# EAGLE design PIUDaughterBoardV2 (EAGLE 7.4.0)
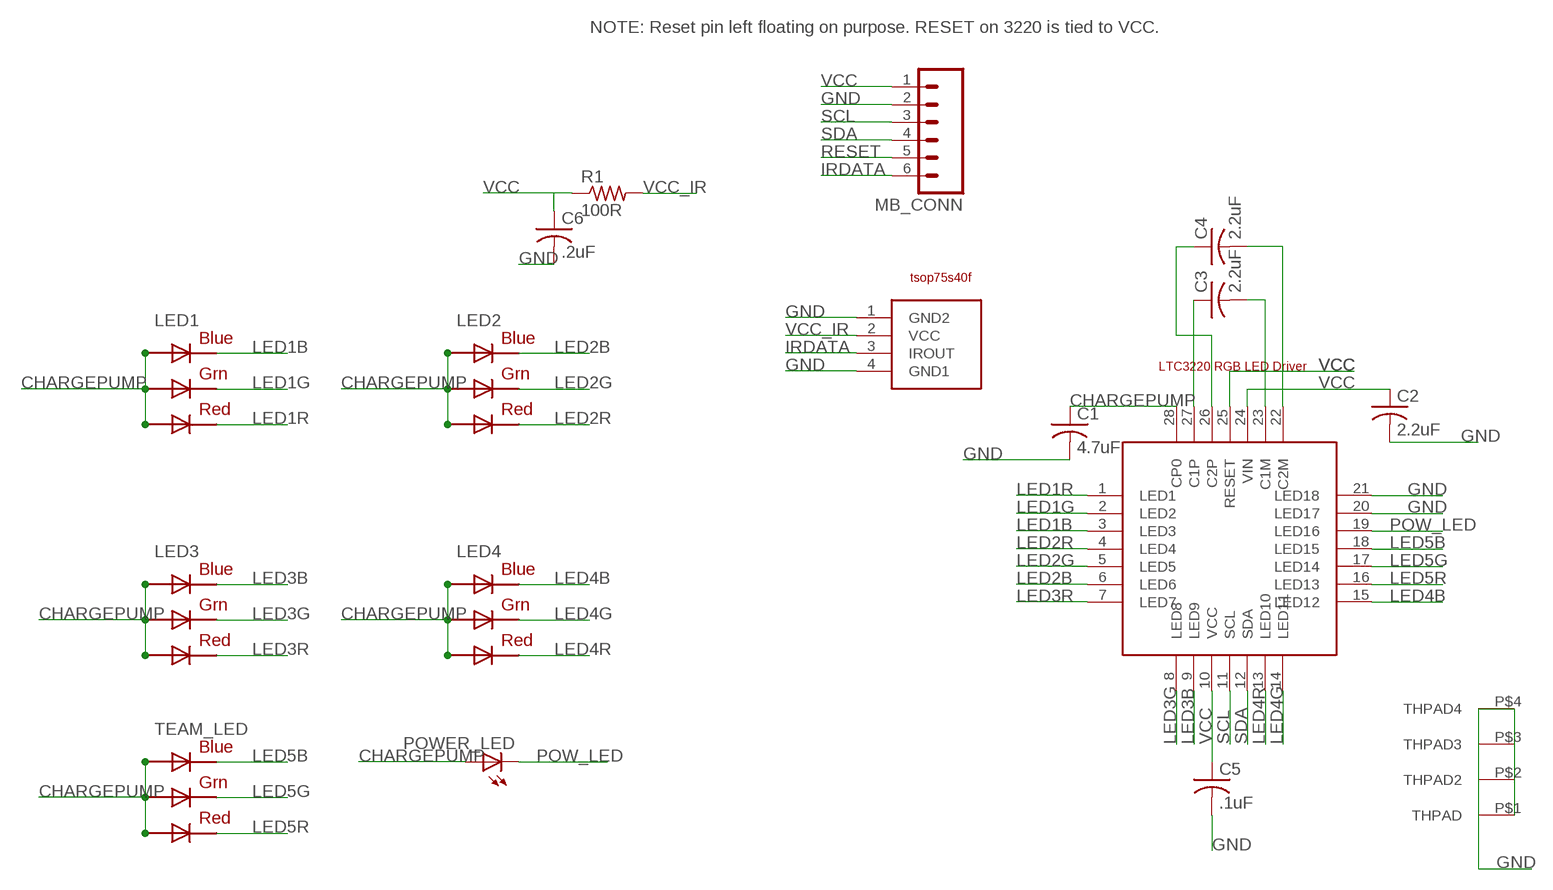
[diagram p0: schematic, sheet 1]

## Parts
C1  4.7uF  C-USC0603  [C0603]
C2  2.2uF  C-USC0603  [C0603]
C3  2.2uF  C-USC0603  [C0603]
C4  2.2uF  C-USC0603  [C0603]
C5  .1uF  C-USC0603  [C0603]
C6  .2uF  C-USC0603  [C0603]
LED1  RGBLED5050  [RGBLED5050]
LED2  RGBLED5050  [RGBLED5050]
LED3  RGBLED5050  [RGBLED5050]
LED4  RGBLED5050  [RGBLED5050]
MB_CONN  M06SMD_MALE  [1X06_SMD_MALE]
POWER_LED  LEDCHIPLED_0805  [CHIPLED_0805]
R1  100R  R-US_R0603  [R0603]
TEAM_LED  RGBLED5050  [RGBLED5050]
U$1  TSOP75S40F  [TSOP75S40F]
U$3  LTC3220  [LTC3220]

## Nets
CHARGEPUMP [ChargePump]: C1.1 LED1.1(GREEN_A) LED1.2(RED_A) LED1.3(BLUE_A) LED2.1(GREEN_A) LED2.2(RED_A) LED2.3(BLUE_A) LED3.1(GREEN_A) LED3.2(RED_A) LED3.3(BLUE_A) LED4.1(GREEN_A) LED4.2(RED_A) LED4.3(BLUE_A) POWER_LED.A TEAM_LED.1(GREEN_A) TEAM_LED.2(RED_A) TEAM_LED.3(BLUE_A) U$3.28(CP0)
GND [GND]: C1.2 C2.2 C5.2 C6.2 MB_CONN.2 U$1.1(GND2) U$1.4(GND1) U$3.20(LED17) U$3.21(LED18) U$3.P$1(THPAD) U$3.P$2(THPAD2) U$3.P$3(THPAD3) U$3.P$4(THPAD4)
IRDATA: MB_CONN.6 U$1.3(IROUT)
LED1B: LED1.4(BLUE_C) U$3.3(LED3)
LED1G: LED1.6(GREEN_C) U$3.2(LED2)
LED1R: LED1.5(RED_C) U$3.1(LED1)
LED2B: LED2.4(BLUE_C) U$3.6(LED6)
LED2G: LED2.6(GREEN_C) U$3.5(LED5)
LED2R: LED2.5(RED_C) U$3.4(LED4)
LED3B: LED3.4(BLUE_C) U$3.9(LED9)
LED3G: LED3.6(GREEN_C) U$3.8(LED8)
LED3R: LED3.5(RED_C) U$3.7(LED7)
LED4B: LED4.4(BLUE_C) U$3.15(LED12)
LED4G: LED4.6(GREEN_C) U$3.14(LED11)
LED4R: LED4.5(RED_C) U$3.13(LED10)
LED5B: TEAM_LED.4(BLUE_C) U$3.18(LED15)
LED5G: TEAM_LED.6(GREEN_C) U$3.17(LED14)
LED5R: TEAM_LED.5(RED_C) U$3.16(LED13)
N$7: C4.2 U$3.22(C2M)
N$8: C3.2 U$3.23(C1M)
N$9: C3.1 U$3.27(C1P)
N$10: C4.1 U$3.26(C2P)
POW_LED: POWER_LED.C U$3.19(LED16)
RESET: MB_CONN.5
SCL: MB_CONN.3 U$3.11(SCL)
SDA: MB_CONN.4 U$3.12(SDA)
VCC [VCC]: C2.1 C5.1 C6.1 MB_CONN.1 R1.1 U$3.10(VCC) U$3.24(VIN) U$3.25(RESET)
VCC_IR: R1.2 U$1.2(VCC)

## Notes on the sheet
- NOTE: Reset pin left floating on purpose. RESET on 3220 is tied to VCC.

## Library data of the parts
C1-C6 = adafruit:C-US: CAPACITOR, American symbol
LED1-LED4 TEAM_LED = adafruit:RGBLED: For 5050 RGB LEDs, the order of the LEDs may vary from one manufacturer to another!
MB_CONN = BryanConnectors:M06: Header 6 Standard 6-pin 0.1" header. Use with straight break away headers (SKU : PRT-00116), right angle break away headers (PRT-00553), swiss pins (PRT-00743), machine pins (PRT-00117), and female headers (PRT-00115). Molex polarized connector foot print use with SKU : PRT-08094 with associated crimp pins and housings. NOTES ON THE VARIANTS LOCK and LOCK_LONGPADS... This footprint was designed to help hold the alignment of a through-hole component (i.e. 6-pin header) while soldering it into place. You may notice that each hole has been shifted either up or down by 0.005 of an inch from it's more standard position (which is a perfectly straight line). This slight alteration caused the pins (the squares in the middle) to touch the edges of the holes. Because they are alternating, it causes a "brace" to hold the component in place. 0.005 has proven to be the perfect amount of "off-center" position when using our standard breakaway headers. Although looks a little odd when you look at the bare footprint, once you have a header in there, the alteration is very hard to notice. Also,if you push a header all the way into place, it is covered up entirely on the bottom side. This idea of altering the position of holes to aid alignment will be further integrated into the Sparkfun Library for other footprints. It can help hold any component with 3 or more connection pins.; PROD_ID: CONN-11293
POWER_LED = adafruit:LED: LED OSRAM: - CHIPLED LG R971, LG N971, LY N971, LG Q971, LY Q971, LO R971, LY R971 LH N974, LH R974 LS Q976, LO Q976, LY Q976 LO Q996 - Hyper CHIPLED LW Q18S LB Q993, LB Q99A, LB R99A - SideLED LS A670, LO A670, LY A670, LG A670, LP A670 LB A673, LV A673, LT A673, LW A673 LH A674 LY A675 LS A676, LA A676, LO A676, LY A676, LW A676 LS A679, LY A679, LG A679 - Hyper Micro SIDELED® LS Y876, LA Y876, LO Y876, LY Y876 LT Y87S - SmartLED LW L88C, LW L88S LB L89C, LB L89S, LG L890 LS L89K, LO L89K, LY L89K LS L896, LA L896, LO L896, LY L896 - TOPLED LS T670, LO T670, LY T670, LG T670, LP T670 LSG T670, LSP T670, LSY T670, LOP T670, LYG T670 LG T671, LOG T671, LSG T671 LB T673, LV T673, LT T673, LW T673 LH T674 LS T676, LA T676, LO T676, LY T676, LB T676, LH T676, LSB T676, LW T676 LB T67C, LV T67C, LT T67C, LS T67K, LO T67K, LY T67K, LW E67C LS E67B, LA E67B, LO E67B, LY E67B, LB E67C, LV E67C, LT E67C LW T67C LS T679, LY T679, LG T679 LS T770, LO T770, LY T770, LG T770, LP T770 LB T773, LV T773, LT T773, LW T773 LH T774 LS E675, LA E675, LY E675, LS T675 LS T776, LA T776, LO T776, LY T776, LB T776 LHGB T686 LT T68C, LB T68C - Hyper Mini TOPLED® LB M676 - Mini TOPLED Santana® LG M470 LS M47K, LO M47K, LY M47K Source: http://www.osram.convergy.de/
R1 = adafruit:R-US_: RESISTOR, American symbol
U$1 = VisayIR:TSOP75S40F
U$3 = linear:LTC3220

## Net classes
0 default: width 0.127 mm
1 GND: width 0.127 mm
2 VCC: width 0.508 mm
3 ChargePump: width 0.508 mm

## Board
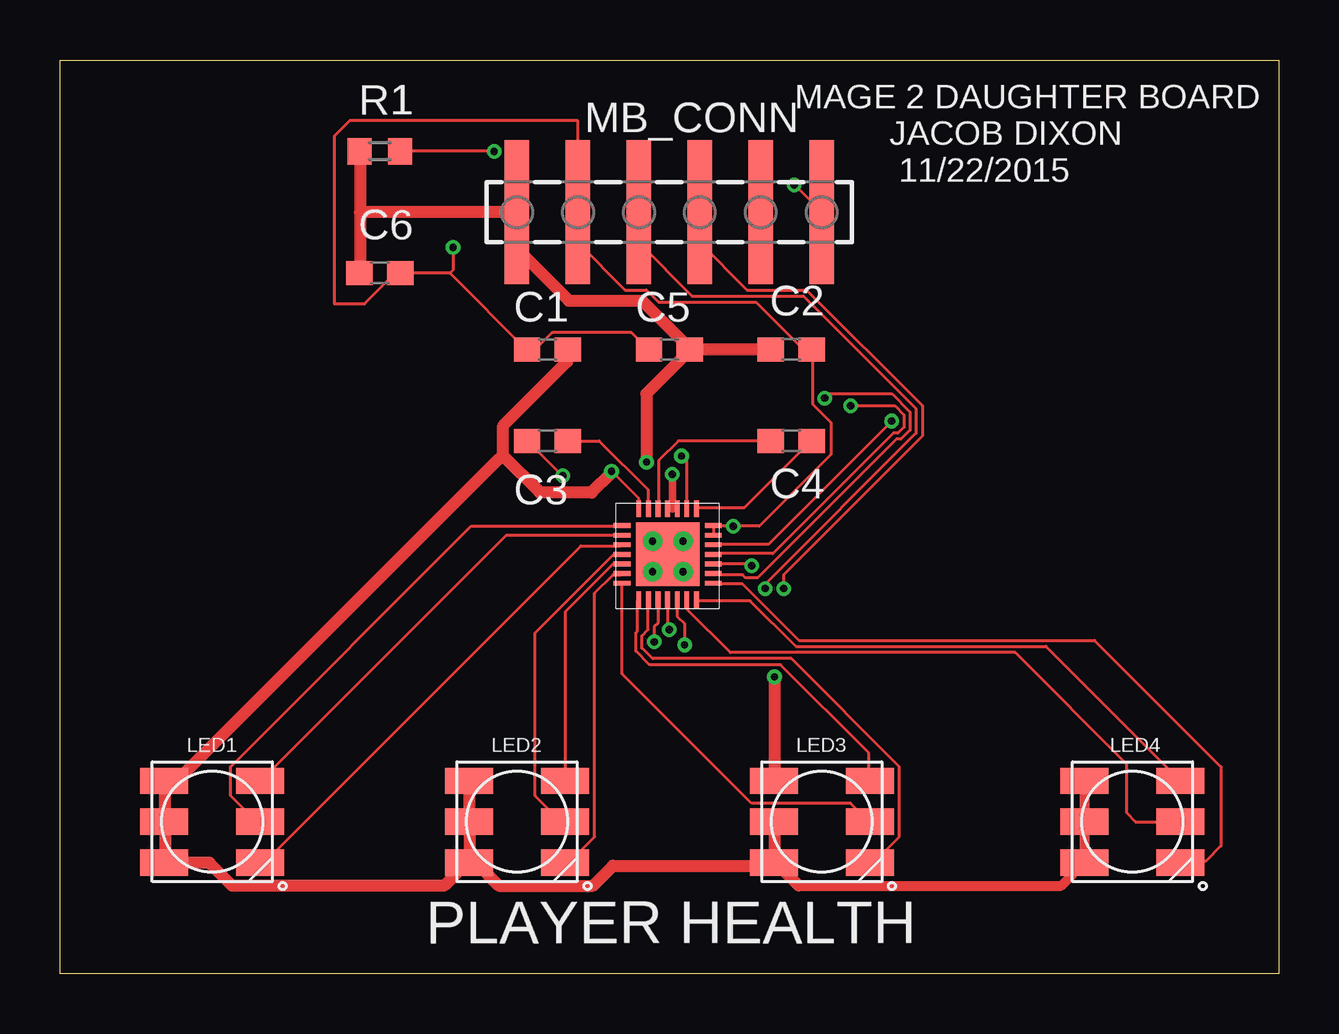
[diagram p1: board, top side]
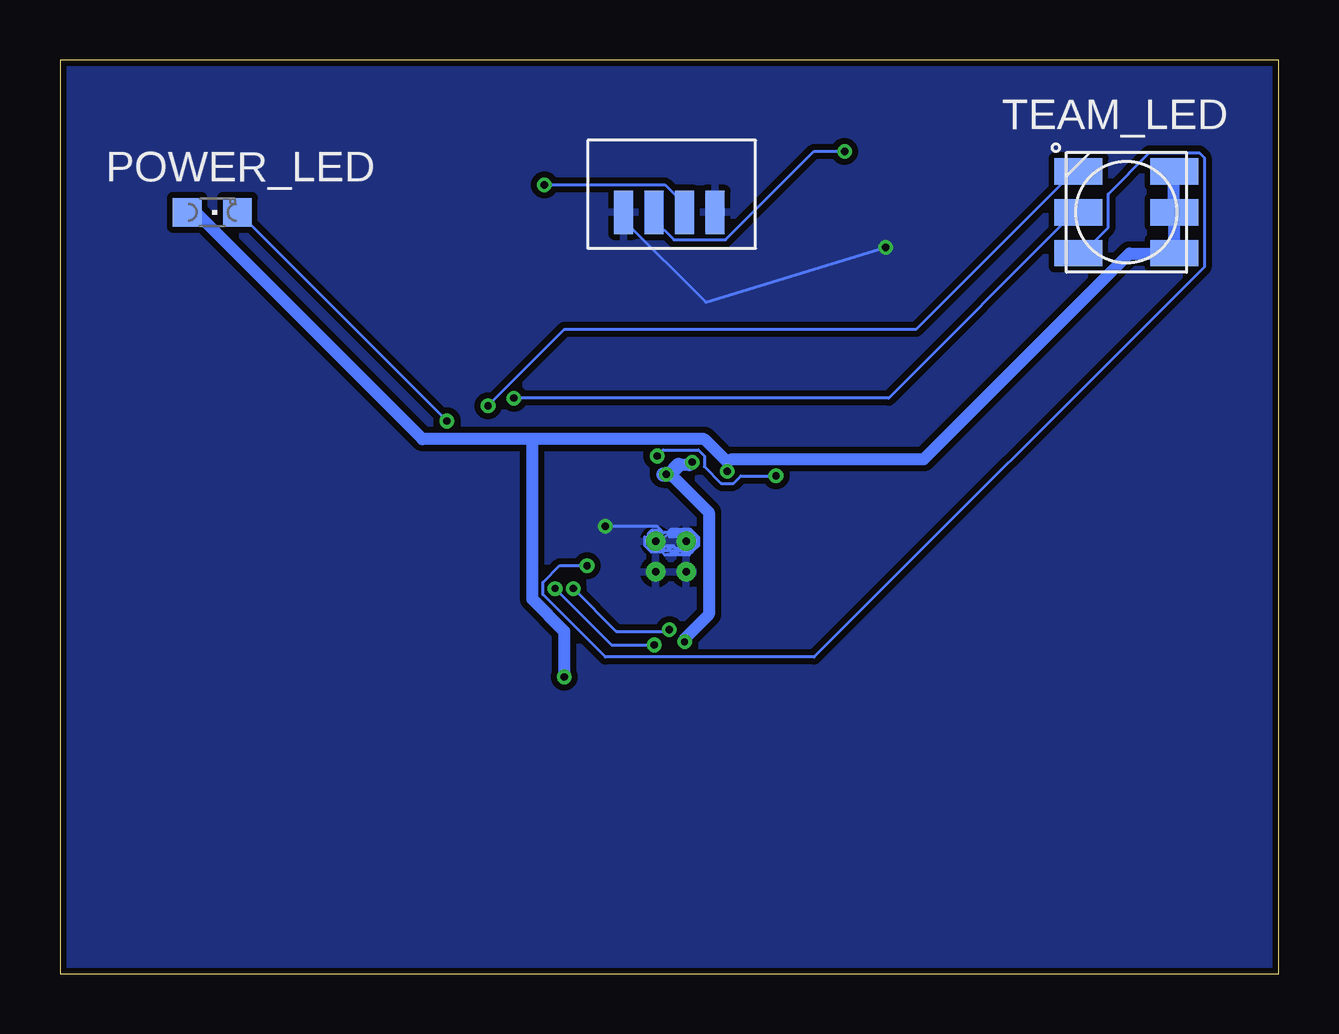
[diagram p2: board, bottom side, seen from below]

Size 50.8 x 38.1 mm. Coordinates in mm from the lower left corner, seen from the top.
Outline: 0,0 0,38.1 50.8,38.1 50.8,0 0,0
Copper layers (1*16): Top 0.035mm / dielectric 1.5mm / Bottom 0.035mm
Design rules "dirt_cheap_dirty_boards.v1": minimum track width 5mil, minimum drill 12mil, track to track 5mil, track to pad 5mil, pad to pad 5mil, via to via 5mil, smd to smd 0mil, copper to edge 10mil, drill to drill 10mil, minimum pad ring 10mil, minimum via ring 6mil, stop-mask expansion 2mil, vias tented up to drill 25mil, thermal gap 10mil

### Footprints (pad centres in the part's own frame; a part is rotated, then mirrored left to right if it is on the bottom)
C0603 = smd 1.1 x 1: 1 -0.85,0; 2 0.85,0
RGBLED5050 = smd 2 x 1.1: 1 -2,1.7; 2 -2,0; 3 -2,-1.7; 4 2,-1.7; 5 2,0; 6 2,1.7
1X06_SMD_MALE = smd 1.02 x 6: 1 0,0; 2 2.54,0; 3 5.08,0; 4 7.62,0; 5 10.16,0; 6 12.7,0
CHIPLED_0805 = smd 1.2 x 1.2: A 0,-1.05; C 0,1.05
R0603 = smd 1 x 1.1: 1 -0.85,0; 2 0.85,0
TSOP75S40F = smd 0.8 x 1.8: 1 0,0; 2 1.27,0; 3 2.54,0; 4 3.81,0
LTC3220 = smd 0.7 x 0.2: 1 0.25,3.45; 2 0.25,3.05; 3 0.25,2.65; 4 0.25,2.25; 5 0.25,1.85; 6 0.25,1.45; 7 0.25,1.05; 15 4.05,1.05; 16 4.05,1.45; 17 4.05,1.85; 18 4.05,2.25; 19 4.05,2.65; 20 4.05,3.05; 21 4.05,3.45 | smd 0.2 x 0.7: 8 0.95,0.35; 9 1.35,0.35; 10 1.75,0.35; 11 2.15,0.35; 12 2.55,0.35; 13 2.95,0.35; 14 3.35,0.35; 22 3.35,4.15; 23 2.95,4.15; 24 2.55,4.15; 25 2.15,4.15; 26 1.75,4.15; 27 1.35,4.15; 28 0.95,4.15 | drill 0.305 pad 0.406: P$1 1.524,2.794; P$2 2.794,2.794; P$3 2.794,1.524; P$4 1.524,1.524 | smd 2.64 x 2.64: THPAD 2.15,2.25

### Placement (x,y rotation side)
C1  20.32,26.04 180 top
C2  30.48,26.04 0 top
C3  20.32,22.23 180 top
C4  30.48,22.23 0 top
C5  25.4,26.04 180 top
C6  13.34,29.21 0 top
LED1  6.35,6.35 0 top
LED2  19.05,6.35 0 top
LED3  31.75,6.35 0 top
LED4  44.7,6.35 0 top
MB_CONN  19.05,31.75 0 top
POWER_LED  44.45,31.75 270 bottom
R1  13.34,34.29 0 top
TEAM_LED  6.35,31.75 180 bottom
U$1  27.3,31.75 0 bottom
U$3  23.18,15.24 0 top

### Tracks (layer width: path | path; a pad name or v marks a point on that pad's centre or on a via)
CHARGEPUMP  (via drill 0.3)
  Top 0.127: U$3.28 24.13,19.81 v22.99,20.95
  Top 0.406: 30.8,3.68 41.74,3.68 LED4.3 LED4.2 LED4.1
  Top 0.508: LED3.3 29.78,4.7 29.78,6.35 LED3.2 | LED2.3 17.08,4.7 17.08,6.35 LED2.2 17.08,6.54 17.08,8 LED2.1 | LED3.3 29.53,4.51 23.05,4.51 22.23,3.68 18.29,3.68 17.34,4.64 LED2.3 | LED2.3 16.83,4.51 16,3.68 7.18,3.68 6.22,4.64 4.64,4.64 LED1.3 4.38,4.7 4.38,6.35 LED1.2 4.38,6.54 4.38,8 LED1.1 4.64,8.06 4.89,8.06 18.29,21.46 18.48,21.59 | 30.8,3.68 29.97,4.51 LED3.3 | 18.48,21.59 18.48,22.86 21.14,25.53 21.14,26.04 C1.1 | 18.48,21.59 20,20.07 22.16,20.07 22.99,20.89 v22.99,20.95 | v29.78,12.38 29.78,8.06 LED3.1
  Bottom 0.127: v22.99,20.95 22.99,21.34
  Bottom 0.508: TEAM_LED.3 4.38,33.4 4.38,31.94 TEAM_LED.2 4.38,31.75 4.38,30.1 TEAM_LED.1 4.64,30.04 6.22,30.04 14.8,21.46 22.8,21.46 22.99,21.34 23.94,22.29 31.11,22.29 | POWER_LED.A 45.15,31.75 35.69,22.29 31.11,22.29 | v29.78,12.38 29.78,14.29 31.11,15.62 31.11,22.29
GND  (via drill 0.3)
  Top 0.127: C5.2 24.51,26.04 23.81,26.73 20.51,26.73 19.81,26.04 C1.2 19.43,26.04 16.26,29.21 | 16.26,29.21 C6.2 13.97,29.21 12.7,27.94 11.43,27.94 11.43,34.92 12.06,35.56 21.59,35.56 MB_CONN.2 21.59,30.48 23.56,28.51 24.45,28.51 24.96,28 29.02,28 30.99,26.04 C2.2 31.37,26.04 31.37,23.75 32.13,22.99 32.13,21.65 29.15,18.67 v28.07,18.67 27.3,18.67 U$3.21 27.24,18.67 27.24,18.35 U$3.20 | v16.38,30.29 16.38,29.34 16.26,29.21
  Bottom 0.127: v16.38,30.29 23.88,28 27.3,31.43 U$1.1 | v28.07,18.67 25.91,18.67 25.72,18.48 25.78,18.41 26.16,18.41 26.16,18.35 25.72,18.35 25.72,18.41 25.78,18.48 26.16,18.48 26.29,18.35 26.29,18.29 25.72,18.29 25.59,18.41 25.46,18.41 25.34,18.29 25.27,18.29 25.21,18.35 25.15,18.35 25.15,18.29 25.21,18.22 25.4,18.22 25.4,18.29 25.27,18.41 25.02,18.41 25.02,18.22 25.15,18.22 25.4,18.48 25.34,18.54 24.51,18.54 24.19,18.22 24.19,17.84 24.38,17.65 24.45,17.72 24.32,17.84 24.32,18.03 24.38,18.03 24.64,17.78 24.45,17.59 24.57,17.46 25.59,17.46 25.78,17.65 26.16,17.65 26.29,17.78 26.29,17.84 25.84,17.84 25.65,17.65 25.46,17.65 25.4,17.72 25.34,17.65 25.15,17.65 25.15,17.72 25.21,17.78 25.46,17.78 25.46,17.72 25.34,17.59 25.02,17.59 25.02,17.65 25.21,17.84 25.53,17.84 25.78,17.59 26.16,17.59 26.42,17.84 26.42,18.22 25.59,18.22 25.34,18.48 24.83,18.48 24.77,18.41 24.51,18.41 24.32,18.22 24.32,18.16 24.89,17.59 25.02,17.72 24.96,17.78 24.89,17.72 24.83,17.72 24.77,17.78 24.77,17.84 25.02,17.84 25.02,17.78 24.83,17.59 24.51,17.59 24.26,17.84 24.26,18.22 24.51,18.48 24.77,18.48 24.89,18.35 24.89,18.22 24.77,18.22 24.77,18.29 24.89,18.41 24.96,18.41 24.96,18.16 U$3.P$1 | U$3.P$2
  pour Bottom (isolate 0.254): 0,38.1 50.8,38.1 50.8,0 0,0
IRDATA  (via drill 0.3)
  Top 0.127: MB_CONN.6 v30.61,32.89
  Bottom 0.127: U$1.3 24.77,32.07 25.59,32.89 v30.61,32.89
LED1B
  Top 0.127: U$3.3 23.37,17.84 21.72,17.84 8.57,4.7 8.38,4.7 LED1.4
LED1G
  Top 0.127: U$3.2 23.37,18.29 18.61,18.29 8.38,8.06 LED1.6
LED1R
  Top 0.127: LED1.5 8.19,6.35 7.11,7.43 7.11,8.64 17.14,18.67 23.37,18.67 U$3.1
LED2B
  Top 0.127: U$3.6 23.37,16.64 23.05,16.64 22.29,15.88 22.29,5.71 21.27,4.7 21.08,4.7 LED2.4
LED2G
  Top 0.127: U$3.5 23.37,17.08 23.05,17.08 21.08,15.11 21.08,8.06 LED2.6
LED2R
  Top 0.127: LED2.5 20.89,6.35 19.81,7.43 19.81,14.22 23.05,17.46 23.37,17.46 U$3.4
LED3B
  Top 0.127: U$3.9 24.51,15.56 24.51,14.35 24.26,14.1 24.26,13.59 24.7,13.14 30.48,13.14 34.99,8.64 34.99,5.71 33.97,4.7 33.78,4.7 LED3.4
LED3G
  Top 0.127: U$3.8 24.07,15.56 24.07,14.29 24,14.22 24,13.46 24.57,12.89 30.04,12.89 33.72,9.21 33.72,8.06 LED3.6
LED3R
  Top 0.127: U$3.7 23.43,16.26 23.43,12.51 28.83,7.11 32.96,7.11 33.72,6.35 LED3.5
LED4B
  Top 0.127: U$3.15 27.24,16.26 28.45,16.26 30.8,13.91 43.12,13.91 48.39,8.64 48.39,5.33 47.75,4.7 46.75,4.7 LED4.4
LED4G
  Top 0.127: U$3.14 26.54,15.56 28.77,15.56 30.67,13.65 41.1,13.65 LED4.6
LED4R
  Top 0.127: U$3.13 26.16,15.56 26.16,15.18 27.94,13.4 39.81,13.4 44.45,8.76 44.45,6.73 44.83,6.35 LED4.5
LED5B  (via drill 0.3)
  Top 0.127: v32.96,23.69 34.8,23.69 35.18,23.3 35.18,22.8 34.92,22.54 34.73,22.54 29.72,17.53 27.24,17.53 U$3.18
  Bottom 0.127: v32.96,23.69 29.78,26.86 15.11,26.86 8.57,33.4 8.38,33.4 TEAM_LED.4
LED5G  (via drill 0.3)
  Top 0.127: v28.83,17.02 28.77,17.08 U$3.17
  Bottom 0.127: v28.83,17.02 29.97,17.02 30.67,16.32 30.67,15.81 28.07,13.21 19.37,13.21 3.11,29.46 3.11,34.04 3.3,34.23 5.4,34.23 7.11,32.51 7.11,31.11 8.13,30.1 8.32,30.1 TEAM_LED.6
LED5R  (via drill 0.3)
  Top 0.127: v31.88,24 32.07,24.19 34.67,24.19 35.43,23.43 35.43,22.67 35.05,22.29 34.86,22.29 29.08,16.51 28.57,16.51 28.45,16.64 27.24,16.64 U$3.16
  Bottom 0.127: v31.88,24 16.26,24 8.51,31.75 TEAM_LED.5
N$7
  Top 0.127: U$3.22 26.54,19.43 28.51,19.43 31.3,22.23 C4.2
N$8  (via drill 0.3)
  Top 0.127: U$3.23 26.13,21.37 v25.91,21.59 | v20.95,20.77 19.49,22.23 C3.2
  Bottom 0.127: v25.91,21.59 25.65,21.84 24.19,21.84 23.94,21.59 23.94,21.14 23.24,20.45 22.73,20.45 22.42,20.77 v20.95,20.77
N$9
  Top 0.127: C3.1 22.48,22.23 24.51,20.19 24.51,19.43 U$3.27
N$10
  Top 0.127: C4.1 25.78,22.23 24.96,21.4 24.96,19.43 U$3.26
POW_LED  (via drill 0.3)
  Top 0.127: v34.67,23.05 29.53,17.91 27.24,17.91 U$3.19
  Bottom 0.127: v34.67,23.05 43.37,31.75 POWER_LED.C
SCL  (via drill 0.3)
  Top 0.127: U$3.11 25.33,14.42 v25.4,14.35 | v29.4,16.07 29.4,16.26 35.69,22.54 35.69,23.56 30.99,28.26 26.35,28.26 24.13,30.48 MB_CONN.3
  Bottom 0.127: 25.53,14.22 v25.4,14.35 25.53,14.29 27.62,14.29 v29.4,16.07
SDA  (via drill 0.3)
  Top 0.127: U$3.12 25.73,14.91 26.04,14.61 v26.04,13.72 | v30.16,16.07 30.16,16.64 35.94,22.42 35.94,23.69 31.11,28.51 28.64,28.51 26.67,30.48 MB_CONN.4
  Bottom 0.127: 26.04,13.46 v26.04,13.72 27.81,13.72 v30.16,16.07
VCC  (via drill 0.3)
  Top 0.127: U$3.10 24.93,14.64 24.77,14.48 v24.77,13.84
  Top 0.178: U$3.25 25.53,19.39 U$3.24
  Top 0.305: v25.53,20.83 25.53,19.39
  Top 0.508: 12.51,31.75 12.51,34.29 R1.1 | 12.51,31.75 12.51,29.21 C6.1 | C2.1 C5.1 | C5.1 26.1,26.23 24.26,28.07 21.21,28.07 19.05,30.23 MB_CONN.1 12.51,31.75 | v24.45,21.34 24.45,24.19 26.1,25.84 C5.1
  Bottom 0.127: v24.77,13.84 24.77,13.72 | 25.4,20.83 25.53,20.95 25.65,20.83
  Bottom 0.508: v24.77,13.84 24.77,13.97 23.75,14.99 23.75,19.24 25.34,20.83 25.4,20.83 v25.53,20.83 | 25.02,21.21 24.57,21.21 v24.45,21.34
  Bottom 0.61: 25.65,20.83 25.4,20.83 25.02,21.21
VCC_IR  (via drill 0.3)
  Top 0.127: v18.1,34.29 R1.2
  Bottom 0.127: v18.1,34.29 19.37,34.29 23.05,30.61 25.21,30.61 26.04,31.43 U$1.2

### Text on the board
_tsilk: MAGE 2 DAUGHTER BOARD / JACOB DIXON / 11/22/2015 | PLAYER HEALTH